# Altium schematic sheet Sheet2.SchDoc
size A4
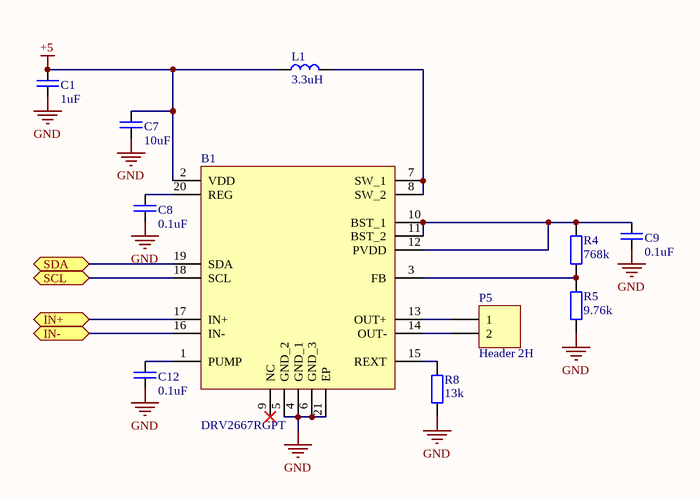
[diagram p0: Sheet2.SchDoc]

## Parts
B1  DRV2667RGPT  [QFN50P400X400X100-21N-D]
C1  1uF  [C2012_0805I_M]
C7  10uF  [C2012_0805I_M]
C8  0.1uF  [R1005_0402i_M]
C9  0.1uF  [C3216_1206I_L]
C12  0.1uF  [R1005_0402i_M]
L1  3.3uH  [INDUCTOR]
P5  Header 2H  [HDR1X2H]
R4  768k  [R1005_0402i_M]
R5  9.76k  [R1005_0402i_M]
R8  13k  [R1005_0402i_M]

## Ports
IN+ (bidir), IN- (bidir), SCL (bidir), SDA (bidir)

## Nets
+5: B1.2(VDD) C1.1 C7.1 L1.1
GND: B1.4(GND_1) B1.5(GND_2) B1.6(GND_3) B1.21(EP) C1.2 C7.2 C8.2 C9.2 C12.2 R5.2 R8.2
IN+: B1.17(IN+) ; port IN+
IN-: B1.16(IN-) ; port IN-
SCL: B1.18(SCL) ; port SCL
SDA: B1.19(SDA) ; port SDA
NetB1_1: B1.1(PUMP) C12.1
NetB1_3: B1.3(FB) R4.2 R5.1
NetB1_7: B1.7(SW_1) B1.8(SW_2) L1.2
NetB1_10: B1.10(BST_1) B1.11(BST_2) B1.12(PVDD) C9.1 R4.1
NetB1_13: B1.13(OUT+) P5.1
NetB1_14: B1.14(OUT-) P5.2
NetB1_15: B1.15(REXT) R8.1
NetB1_20: B1.20(REG) C8.1

Not connected (* = marked no-connect by the designer): B1 9(NC)*

## Library data of the parts
B1 = DRV2667RGPT: Motor / Motion / Ignition Controllers & Drivers Piezo Haptic Dvr w/ Boost Digital FE; Manufacturer_Name: Texas Instruments; Geometry.Height: 1mm; Mouser Part Number: 595-DRV2667RGPT; Mouser Price/Stock: https://www.mouser.co.uk/ProductDetail/Texas-Instruments/DRV2667RGPT?qs=5T7hXpf2iWdxn16iAzW0AQ%3D%3D; Manufacturer_Part_Number: DRV2667RGPT; Datasheet Link: https://www.ti.com/lit/ds/symlink/drv2667.pdf?HQS=TI-null-null-digikeymode-df-pf-null-wwe&ts=1600079349195
C1 C7-C9 C12 = C: Capacitor
L1 = L
P5 = Header 2H: Header, 2-Pin, Right Angle; LatestRevisionDate: 17-Jul-2002; LatestRevisionNote: Re-released for DXP Platform.; Publisher: Altium Limited
R4 R5 R8 = R